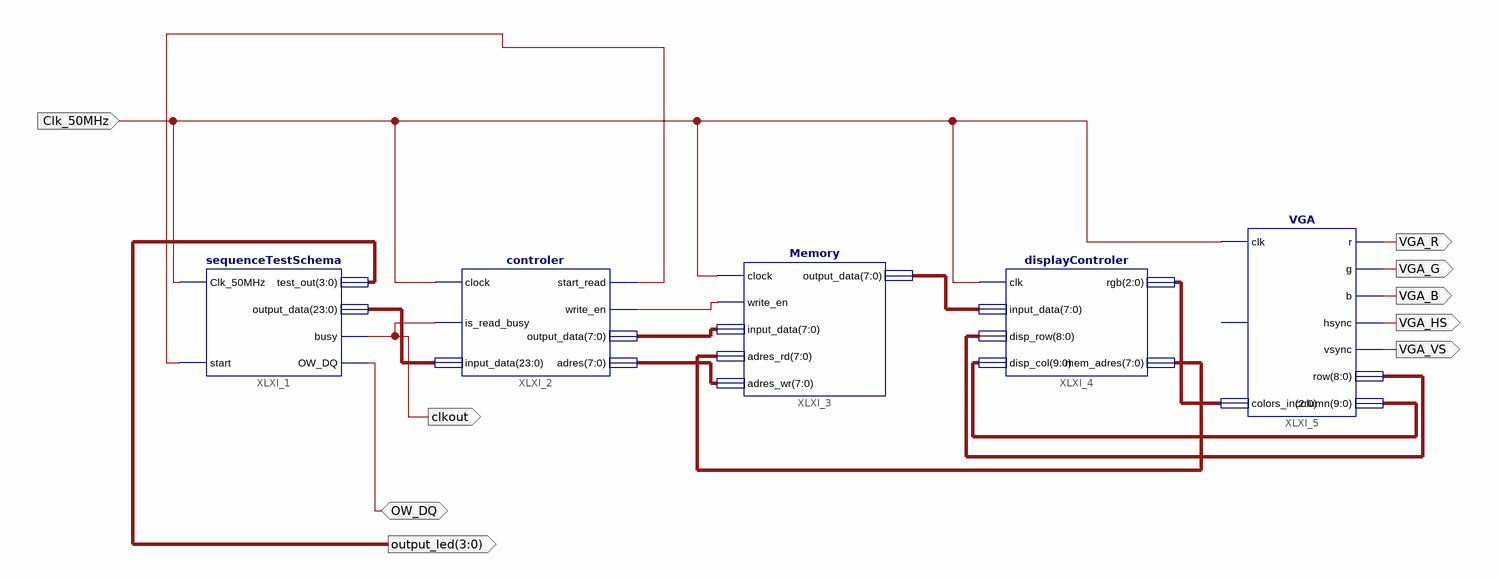
[diagram p0: schematic sheet 1]
// Xilinx ISE schematic temperatureSystem.sch (spartan3e) as structural Verilog: 5 symbols, 9 ports
module temperatureSystem (
  input  Clk_50MHz,
  inout  OW_DQ,
  output clkout,
  output VGA_R,
  output VGA_G,
  output VGA_B,
  output VGA_HS,
  output VGA_VS,
  output [3:0] output_led
);

  wire XLXN_5, XLXN_37;
  wire [2:0] XLXN_7;
  wire [7:0] XLXN_3, XLXN_4, XLXN_6, XLXN_8;
  wire [8:0] XLXN_10;
  wire [9:0] XLXN_12;
  wire [23:0] XLXN_1;

  sequenceTestSchema XLXI_1 (
    .Clk_50MHz(Clk_50MHz), .start(XLXN_37), .test_out(output_led), .output_data(XLXN_1), .busy(clkout),
    .OW_DQ(OW_DQ));
  controler XLXI_2 (
    .clock(Clk_50MHz), .is_read_busy(clkout), .input_data(XLXN_1), .start_read(XLXN_37), .write_en(XLXN_5),
    .output_data(XLXN_3), .adres(XLXN_4));
  Memory XLXI_3 (
    .clock(Clk_50MHz), .write_en(XLXN_5), .input_data(XLXN_3), .adres_rd(XLXN_8), .adres_wr(XLXN_4),
    .output_data(XLXN_6));
  displayControler XLXI_4 (
    .clk(Clk_50MHz), .input_data(XLXN_6), .disp_row(XLXN_10), .disp_col(XLXN_12), .rgb(XLXN_7),
    .mem_adres(XLXN_8));
  VGA XLXI_5 (
    .clk(Clk_50MHz), .colors_in(XLXN_7), .r(VGA_R), .g(VGA_G), .b(VGA_B), .hsync(VGA_HS), .vsync(VGA_VS),
    .row(XLXN_10), .column(XLXN_12));  // open: reset
endmodule
